# EAGLE design blink1_v2c (EAGLE 6.4)
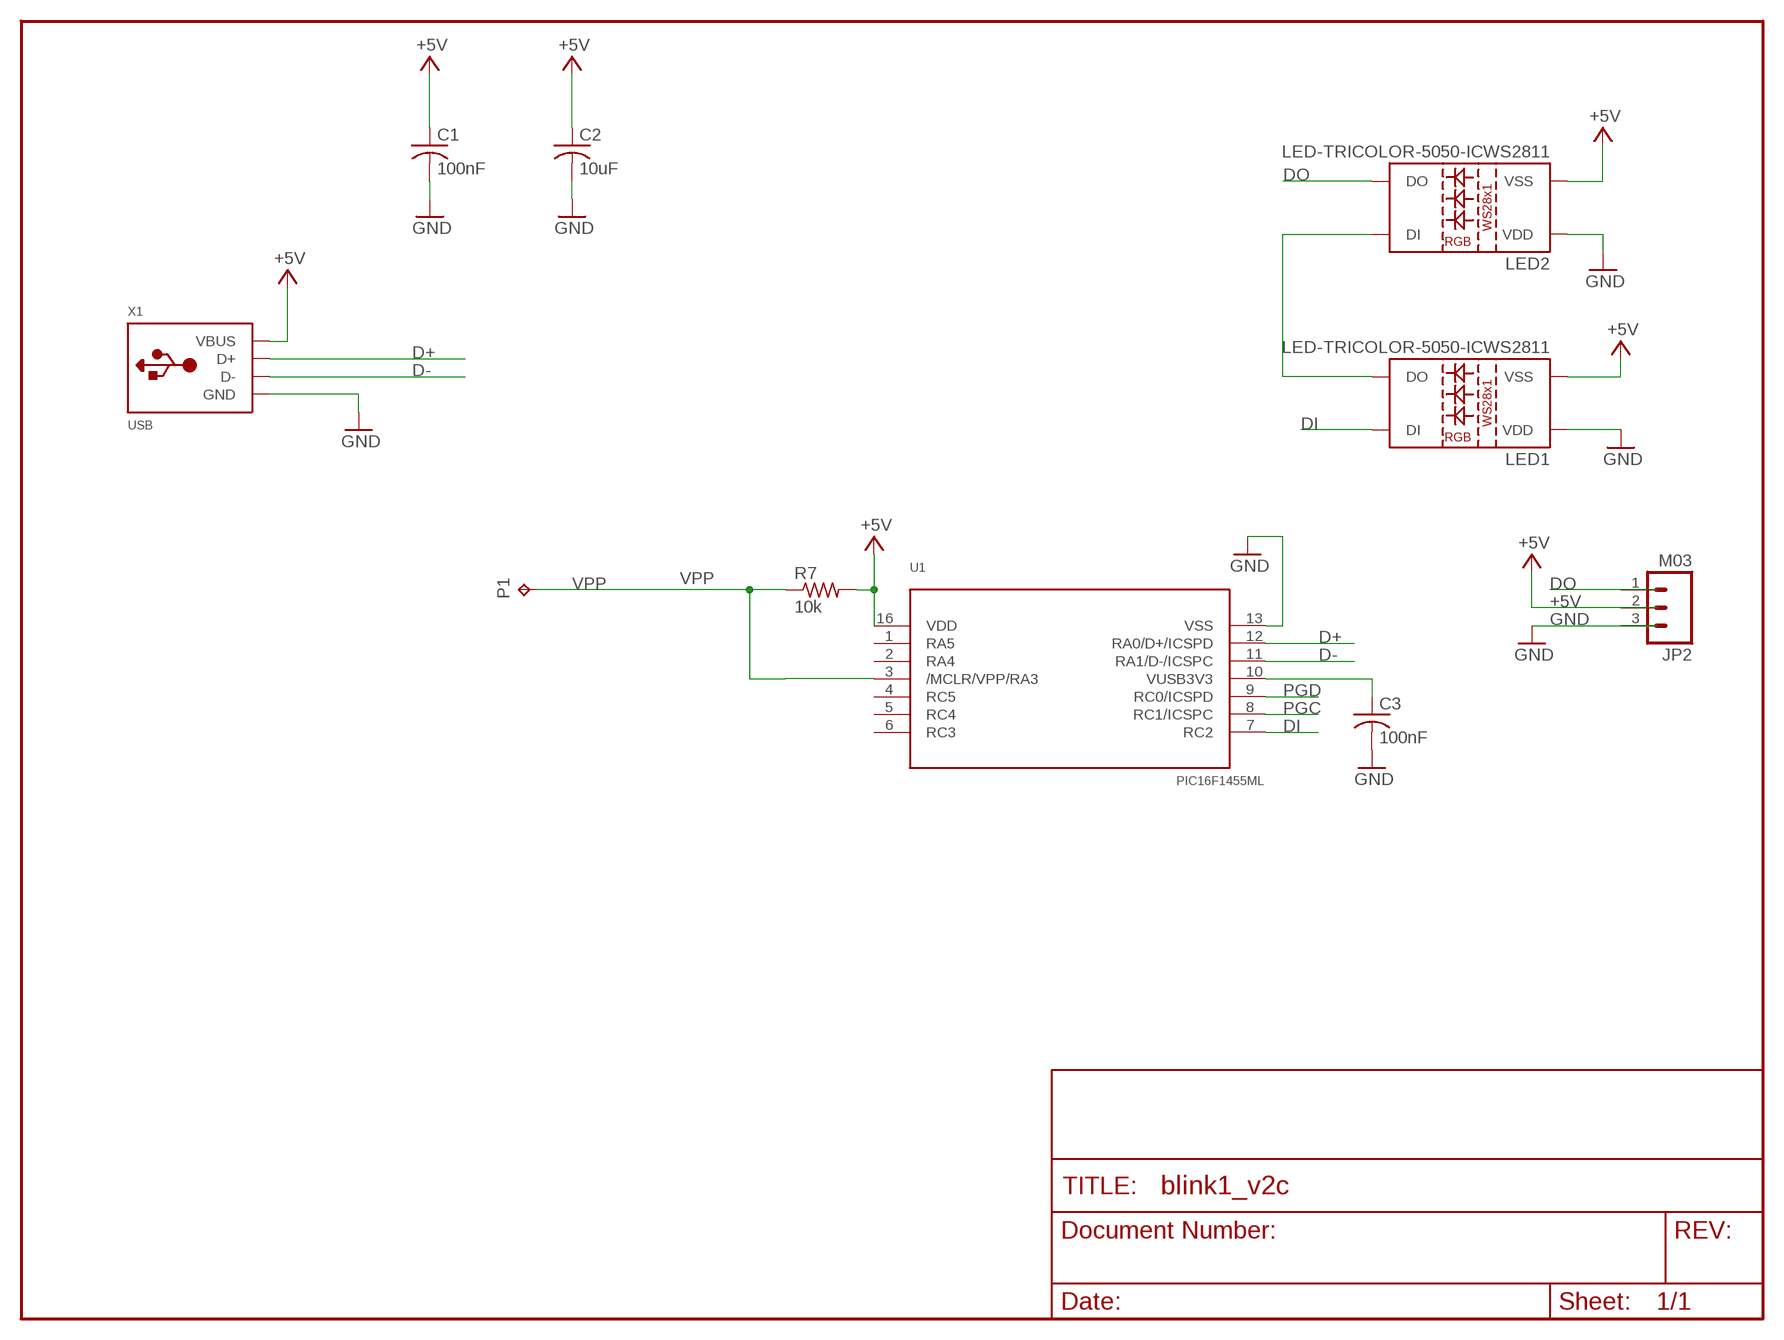
[diagram p0: schematic, sheet 1]

## Parts
C1  100nF  C-USC0603  [C0603]
C2  10uF  C-USC0603  [C0603]
C3  100nF  C-USC0603  [C0603]
JP2  M03  [1X03-1.27MM]
LED1  LED-TRICOLOR-5050-ICWS2811  [LED-TRICOLOR-5050-IC]
LED2  LED-TRICOLOR-5050-ICWS2811  [LED-TRICOLOR-5050-IC]
P1  TPTP11SQ  [TP11SQ]
R7  10k  R-US_R0603  [R0603]
U1  PIC16F1455ML  [QFN16_4X4]
X1  USB  [MOLEX-48037-1000]

## Nets
+5V: C1.1 C2.1 JP2.2 LED1.6(VSS) LED2.6(VSS) R7.2 U1.16(VDD) X1.1(VBUS)
D+: U1.12(RA0/D+/ICSPD) X1.3(D+)
D-: U1.11(RA1/D-/ICSPC) X1.2(D-)
DI: LED1.2(DI) U1.7(RC2)
DO: JP2.1 LED2.1(DO)
GND: C1.2 C2.2 C3.2 JP2.3 LED1.3(VDD) LED1.5(VDD) LED2.3(VDD) LED2.5(VDD) U1.13(VSS) X1.4(GND)
N$1: LED1.1(DO) LED2.2(DI)
PGC: U1.8(RC1/ICSPC)
PGD: U1.9(RC0/ICSPD)
VPP: P1.TP R7.1 U1.3(/MCLR/VPP/RA3)
VUSB3V3: C3.1 U1.10(VUSB3V3)
Unconnected: U1.1(RA5) U1.2(RA4) U1.4(RC5) U1.5(RC4) U1.6(RC3)

## Library data of the parts
C1-C3 = rcl:C-US: CAPACITOR, American symbol
JP2 = todstuff:M03
LED1 LED2 = SparkFun-LED:LED-TRICOLOR-5050-IC: 5x5mm SMD LED with built-in controller IC.
P1 = testpad:TP: Test pad
R7 = rcl:R-US_: RESISTOR, American symbol
U1 = todstuffnew:PIC16F1455
X1 = todstuff:USB

## Board
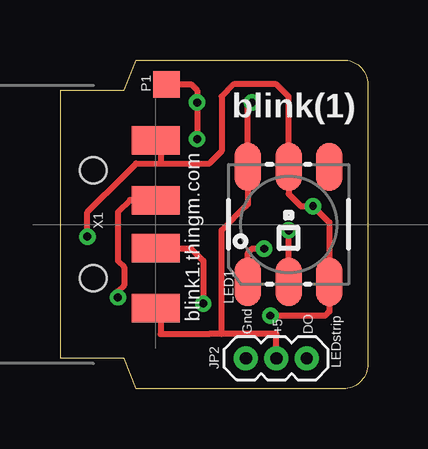
[diagram p1: board, top side]
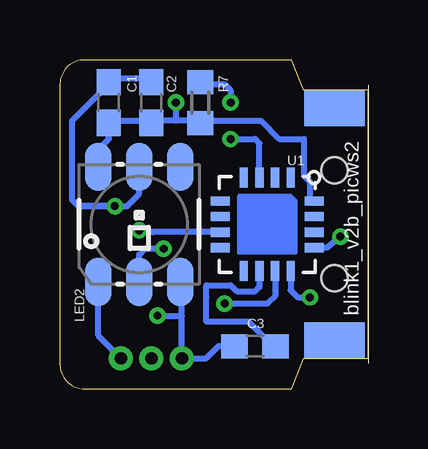
[diagram p2: board, bottom side, seen from below]

Size 12.83 x 13.72 mm. Coordinates in mm from the lower left corner, seen from the top.
Outline: 0,12.45 2.67,12.45 3.17,13.72 11.81,13.72 arc-90 12.83,12.7 12.83,1.02 arc-90 11.81,0 3.17,0 2.67,1.27 0,1.27 0,12.45
Copper layers (1*16): Top 0.0356mm / dielectric 1.5011mm / Bottom 0.0356mm
Design rules "LaenPCBOrder *": minimum track width 10mil, minimum drill 13mil, track to track 6mil, track to pad 8mil, pad to pad 8mil, via to via 8mil, smd to smd 6mil, copper to edge 15mil, drill to drill 8mil, minimum pad ring 7mil, minimum via ring 7mil, stop-mask expansion 4mil, vias tented up to drill 25mil, thermal gap 10mil
tRestrict: area -2.4,3 to -1.1,10.7

### Footprints (pad centres in the part's own frame; a part is rotated, then mirrored left to right if it is on the bottom)
C0603 = smd 1.1 x 1: 1 -0.85,0; 2 0.85,0
1X03-1.27MM = drill 0.508 pad 1: 1 0,0; 2 1.27,0; 3 2.54,0
LED-TRICOLOR-5050-IC = smd 2 x 1.1: 1 -2.4,1.7; 2 -2.4,0; 3 -2.4,-1.7; 4 2.4,-1.7; 5 2.4,0; 6 2.4,1.7
TP11SQ = smd 1.1 x 1.1: TP 0,0
R0603 = smd 1 x 1.1: 1 -0.85,0; 2 0.85,0
QFN16_4X4 = smd 0.8 x 0.35: 1 -1.95,0.975; 2 -1.95,0.325; 3 -1.95,-0.325; 4 -1.95,-0.975; 9 1.95,-0.975; 10 1.95,-0.325; 11 1.95,0.325; 12 1.95,0.975 | smd 0.35 x 0.8: 5 -0.975,-1.95; 6 -0.325,-1.95; 7 0.325,-1.95; 8 0.975,-1.95; 13 0.975,1.95; 14 0.325,1.95; 15 -0.325,1.95; 16 -0.975,1.95
MOLEX-48037-1000 = smd 2 x 1.2: 1 2.6,-3.5; 2 2.6,-1; 3 2.6,1; 4 2.6,3.5 | smd 2.54 x 1.524 bottom: P$1 0,4.85; P$2 0,-4.85 | hole 1.1: 0,2.25; 0,-2.25

### Placement (x,y rotation side)
C1  10.79,11.94 90 bottom
C2  9.02,11.94 90 bottom
C3  4.7,1.78 180 bottom
JP2  10.29,1.27 180 top
LED1  9.52,6.86 90 top
LED2  9.52,6.86 90 bottom
P1  4.45,12.7 0 top
R7  6.99,11.94 270 bottom
U1  4.19,6.86 270 bottom
X1  1.39,6.86 0 top

### Tracks (layer width: path | path; a pad name or v marks a point on that pad's centre or on a via)
+5V  (via drill 0.33)
  Top 0.254: 6.73,2.29 9.02,2.29 JP2.2 | 6.73,2.29 6.22,2.29 4.19,2.29 4.19,3.3 X1.1 | 6.73,2.29 6.73,6.6 7.75,7.62 7.83,7.7 LED1.6 7.83,11.76 | 7.83,11.76 v8,11.94 7.83,11.76
  Bottom 0.254: 9.02,11.18 10.79,11.18 C1.1 | 9.02,11.18 C2.1 9.02,11.18 | 10.79,10.92 C1.1 | 6.99,11.18 4.45,11.18 3.68,10.41 2.67,10.41 2.67,8.89 2.41,8.64 2.41,7.87 U1.16 | 6.99,11.18 R7.2 6.99,11.18 | 6.99,11.18 8,11.18 | 8,11.18 9.02,11.18 | v8,11.94 8,11.18 | LED2.6 11.22,9.98 10.79,10.41 C1.1
D+  (via drill 0.33)
  Top 0.254: v2.41,3.81 2.41,4.06 2.67,4.32 2.67,5.08 2.41,5.33 2.41,6.35 2.41,7.37 2.92,7.87 3.94,7.87 X1.3
  Bottom 0.254: 2.67,3.81 v2.41,3.81 2.92,3.81 3.22,4.11 U1.12
D-  (via drill 0.33)
  Top 0.254: X1.2 5.45,5.86 5.97,5.33 v5.97,3.56
  Bottom 0.254: v5.97,3.56 4.19,3.56 3.87,3.88 U1.11
DI  (via drill 0.33)
  Top 0.254: v9.52,6.6 9.52,6.1 9.52,4.57 LED1.2
  Bottom 0.254: U1.7 8.95,6.53 v9.52,6.6
DO
  Bottom 0.254: 11.3,4.32 LED2.1 11.22,2.21 JP2.1
GND  (via drill 0.33)
  Top 0.254: 11.05,4.57 LED1.3 | v8.76,3.05 10.54,3.05 11.05,3.05 11.22,3.22 LED1.3 | X1.4 4.19,10.16 4.19,9.4 | LED1.3 11.22,6.94 v10.54,7.62 10.03,7.62 9.52,8.13 9.52,9.14 LED2.5 9.52,9.4 9.52,11.94 9.52,12.19 9.02,12.7 7.24,12.7 6.73,12.19 6.73,9.91 6.22,9.4 4.19,9.4 | v1.14,6.35 1.14,7.37 2.67,8.89 3.17,9.4 4.19,9.4
  Bottom 0.254: C3.2 5.71,1.78 6.22,1.78 6.73,1.27 JP2.3 7.75,3.05 | 7.75,3.05 7.75,4.32 LED2.3 | C2.2 9.02,12.95 10.79,12.95 C1.2 10.79,12.7 12.32,11.18 12.32,7.87 12.06,7.62 | 9.52,9.14 LED2.5 9.52,8.13 10.03,7.62 12.06,7.62 | v10.54,7.62 12.06,7.62 | v8.76,3.05 7.75,3.05 | U1.13 1.69,5.88 v1.14,6.35
N$1  (via drill 0.33)
  Top 0.254: LED1.1 7.83,5.67 8,5.84 v8.51,5.84
  Bottom 0.254: LED2.2 9.52,4.57 9.52,4.83 9.52,5.59 9.27,5.84 v8.51,5.84
VPP  (via drill 0.33)
  Top 0.254: v5.71,10.41 5.71,10.67 5.71,11.68 v5.71,11.94 5.71,12.45 5.46,12.7 P1.TP
  Bottom 0.254: v5.71,10.41 4.7,10.41 4.52,10.23 U1.3 | R7.1 6.99,12.7 5.97,12.7 5.71,12.45 v5.71,11.94
VUSB3V3
  Bottom 0.254: C3.1 3.94,1.78 4.95,2.79 5.97,2.79 6.22,2.79 6.73,2.79 6.73,3.81 6.73,4.32 5.71,4.32 5.46,4.06 4.7,4.06 4.52,4.25 U1.10

### Text on the board
tPlace: blink(1) | blink1.thingm.com | LEDstrip | Gnd | +5 | DO
bPlace: blink1_v2b_picws2